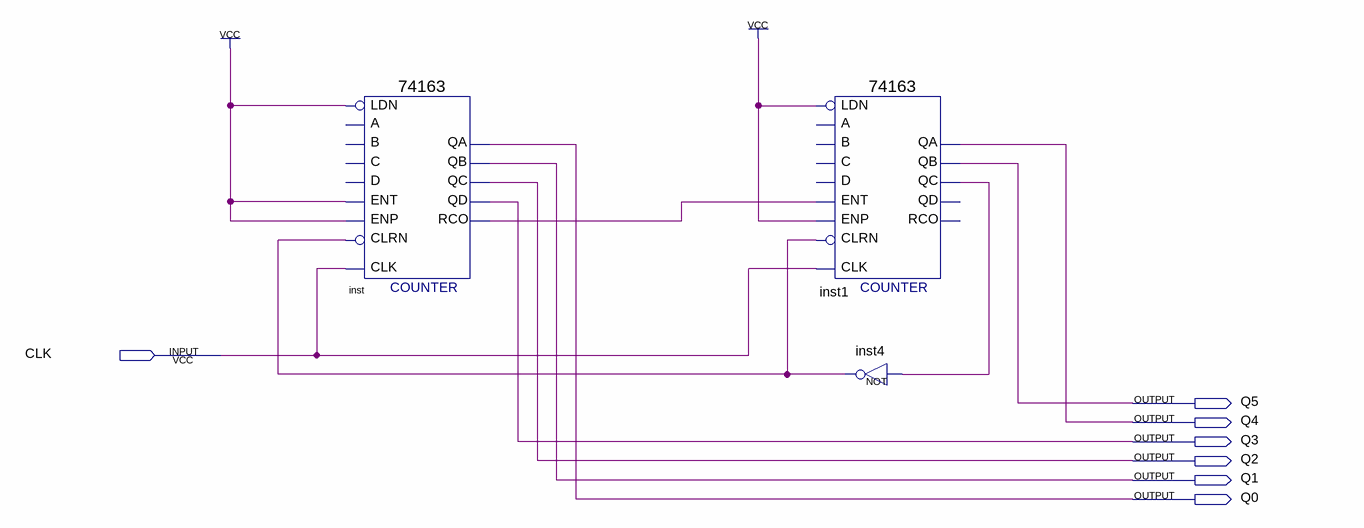
[diagram p0: schematic sheet]
// Quartus schematic Mod64Counter.bdf as structural Verilog: 3 symbols, 7 pins
module Mod64Counter (
  input  CLK,
  output Q5,
  output Q4,
  output Q3,
  output Q2,
  output Q1,
  output Q0
);

  wire inst1_qc, inst4_out, inst_rco;

  \74163  inst (
    .ENT(1'b1), .CLRN(inst4_out), .CLK(CLK), .ENP(1'b1), .LDN(1'b1), .QA(Q0), .QB(Q1), .QC(Q2), .QD(Q3),
    .RCO(inst_rco));  // open: C, B, A, D
  \74163  inst1 (
    .ENT(inst_rco), .CLRN(inst4_out), .CLK(CLK), .ENP(1'b1), .LDN(1'b1), .QA(Q4), .QB(Q5), .QC(inst1_qc));  // open: C, B, A, D, QD, RCO
  not inst4 (inst4_out, inst1_qc);
endmodule
